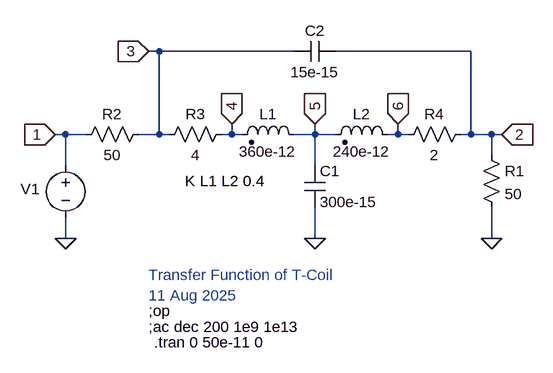
[diagram p0: schematic Transfer_Function_of_T-Coil.asc]
Transfer_Function_of_T-Coil.asc, the LTspice schematic file:
Version 4
SHEET 1 968 680
WIRE 112 -128 96 -128
WIRE 320 -128 112 -128
WIRE 592 -128 384 -128
WIRE -32 0 -48 0
WIRE 0 0 -32 0
WIRE 112 0 112 -128
WIRE 112 0 80 0
WIRE 128 0 112 0
WIRE 224 0 224 -16
WIRE 224 0 208 0
WIRE 240 0 224 0
WIRE 352 0 352 -16
WIRE 352 0 320 0
WIRE 384 0 352 0
WIRE 480 0 480 -16
WIRE 480 0 464 0
WIRE 496 0 480 0
WIRE 592 0 592 -128
WIRE 592 0 576 0
WIRE 624 0 592 0
WIRE 640 0 624 0
WIRE 624 32 624 0
WIRE -32 48 -32 0
WIRE 352 48 352 0
WIRE -32 160 -32 128
WIRE 352 160 352 112
WIRE 624 160 624 112
FLAG -32 160 0
FLAG 352 160 0
FLAG 624 160 0
FLAG -48 0 1
IOPIN -48 0 In
FLAG 352 -16 5
IOPIN 352 -16 In
FLAG 640 0 2
IOPIN 640 0 In
FLAG 480 -16 6
IOPIN 480 -16 In
FLAG 224 -16 4
IOPIN 224 -16 In
FLAG 96 -128 3
IOPIN 96 -128 In
SYMBOL voltage -32 32 R0
WINDOW 0 -69 52 Left 2
WINDOW 3 24 96 Invisible 2
WINDOW 39 0 0 Left 0
SYMATTR InstName V1
SYMATTR Value PULSE(-1 1 10e-12 1e-20 1e-20 100e-12 200e-12 5)
SYMATTR Value2 AC 1
SYMBOL ind2 336 16 M270
WINDOW 0 32 56 VTop 2
WINDOW 3 5 56 VBottom 2
SYMATTR InstName L1
SYMATTR Value 360e-12
SYMATTR Type ind
SYMBOL ind2 480 16 M270
WINDOW 0 32 56 VTop 2
WINDOW 3 5 56 VBottom 2
SYMATTR InstName L2
SYMATTR Value 240e-12
SYMATTR Type ind
SYMBOL cap 336 48 R0
SYMATTR InstName C1
SYMATTR Value 300e-15
SYMBOL cap 384 -144 R90
WINDOW 0 0 32 VBottom 2
WINDOW 3 32 32 VTop 2
SYMATTR InstName C2
SYMATTR Value 15e-15
SYMBOL res 608 16 R0
SYMATTR InstName R1
SYMATTR Value 50
SYMBOL res 96 -16 R90
WINDOW 0 0 56 VBottom 2
WINDOW 3 32 56 VTop 2
SYMATTR InstName R2
SYMATTR Value 50
SYMBOL res 224 -16 R90
WINDOW 0 0 56 VBottom 2
WINDOW 3 32 56 VTop 2
SYMATTR InstName R3
SYMATTR Value 4
SYMBOL res 592 -16 R90
WINDOW 0 0 56 VBottom 2
WINDOW 3 32 56 VTop 2
SYMATTR InstName R4
SYMATTR Value 2
TEXT 152 72 Left 2 !K L1 L2 0.4
TEXT 96 272 Left 2 !;op
TEXT 96 216 Left 2 ;Transfer Function of T-Coil
TEXT 96 248 Left 2 ;11 Aug 2025
TEXT 96 296 Left 2 !;ac dec 200 1e9 1e13
TEXT 104 320 Left 2 !.tran 0 50e-11 0

The netlist it stands for:
* Transfer_Function_of_T-Coil.asc
V1 1 0 PULSE(-1 1 10e-12 1e-20 1e-20 100e-12 200e-12 5) AC 1
L1 5 4 360e-12
L2 6 5 240e-12
C1 5 0 300e-15
C2 2 3 15e-15
R1 2 0 50
R2 3 1 50
R3 4 3 4
R4 2 6 2
K L1 L2 0.4
;op
* Transfer Function of T-Coil
* 11 Aug 2025
;ac dec 200 1e9 1e13
.tran 0 50e-11 0
.backanno
.end